# EAGLE schematic pin (EAGLE 9.6.2)
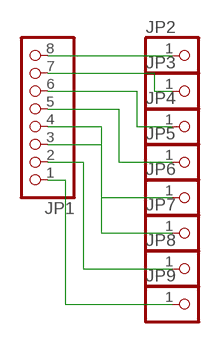
[diagram p0: schematic, sheet 1]

## Parts
JP1  PINHD-1X8  [1X08]
JP2  PINHD-1X1  [1X01]
JP3  PINHD-1X1  [1X01]
JP4  PINHD-1X1  [1X01]
JP5  PINHD-1X1  [1X01]
JP6  PINHD-1X1  [1X01]
JP7  PINHD-1X1  [1X01]
JP8  PINHD-1X1  [1X01]
JP9  PINHD-1X1  [1X01]

## Nets
N$1: JP1.8 JP2.1
N$2: JP1.7 JP3.1
N$3: JP1.6 JP4.1
N$4: JP1.5 JP5.1
N$5: JP1.4 JP6.1
N$6: JP1.3 JP7.1
N$7: JP1.2 JP8.1
N$8: JP1.1 JP9.1

## Library data of the parts
JP1 = pinhead:PINHD-1X8: PIN HEADER
JP2-JP9 = pinhead:PINHD-1X1: PIN HEADER